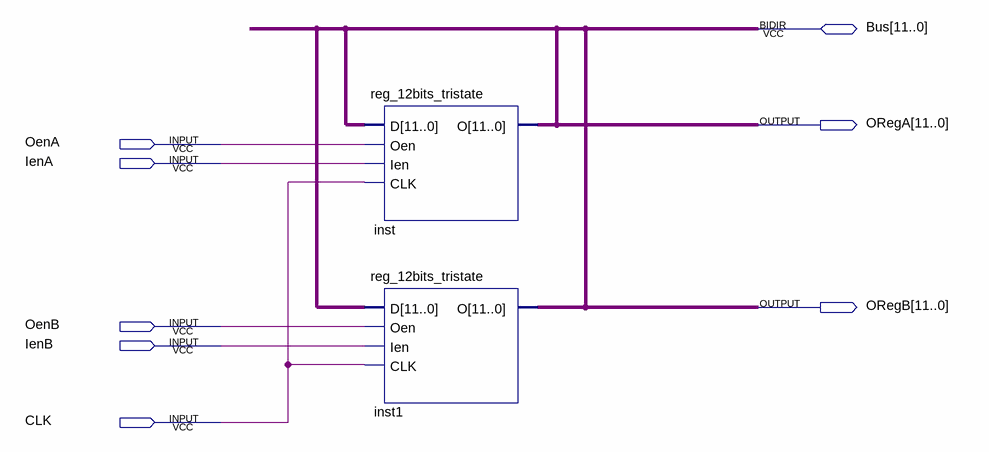
[diagram p0: schematic sheet]
// Quartus schematic almacenamiento.bdf as structural Verilog: 2 symbols, 8 pins
module almacenamiento (
  input  OenA,
  input  IenA,
  input  OenB,
  input  IenB,
  input  CLK,
  inout  [11:0] Bus,
  output [11:0] ORegA,
  output [11:0] ORegB
);

  reg_12bits_tristate inst (.D(Bus), .Oen(OenA), .Ien(IenA), .CLK(CLK), .O(Bus));
  reg_12bits_tristate inst1 (.D(Bus), .Oen(OenB), .Ien(IenB), .CLK(CLK), .O(Bus));

  assign ORegA = Bus;
  assign ORegB = Bus;
endmodule
